# EAGLE schematic SCM-140-ADSR (EAGLE 7.6.0)
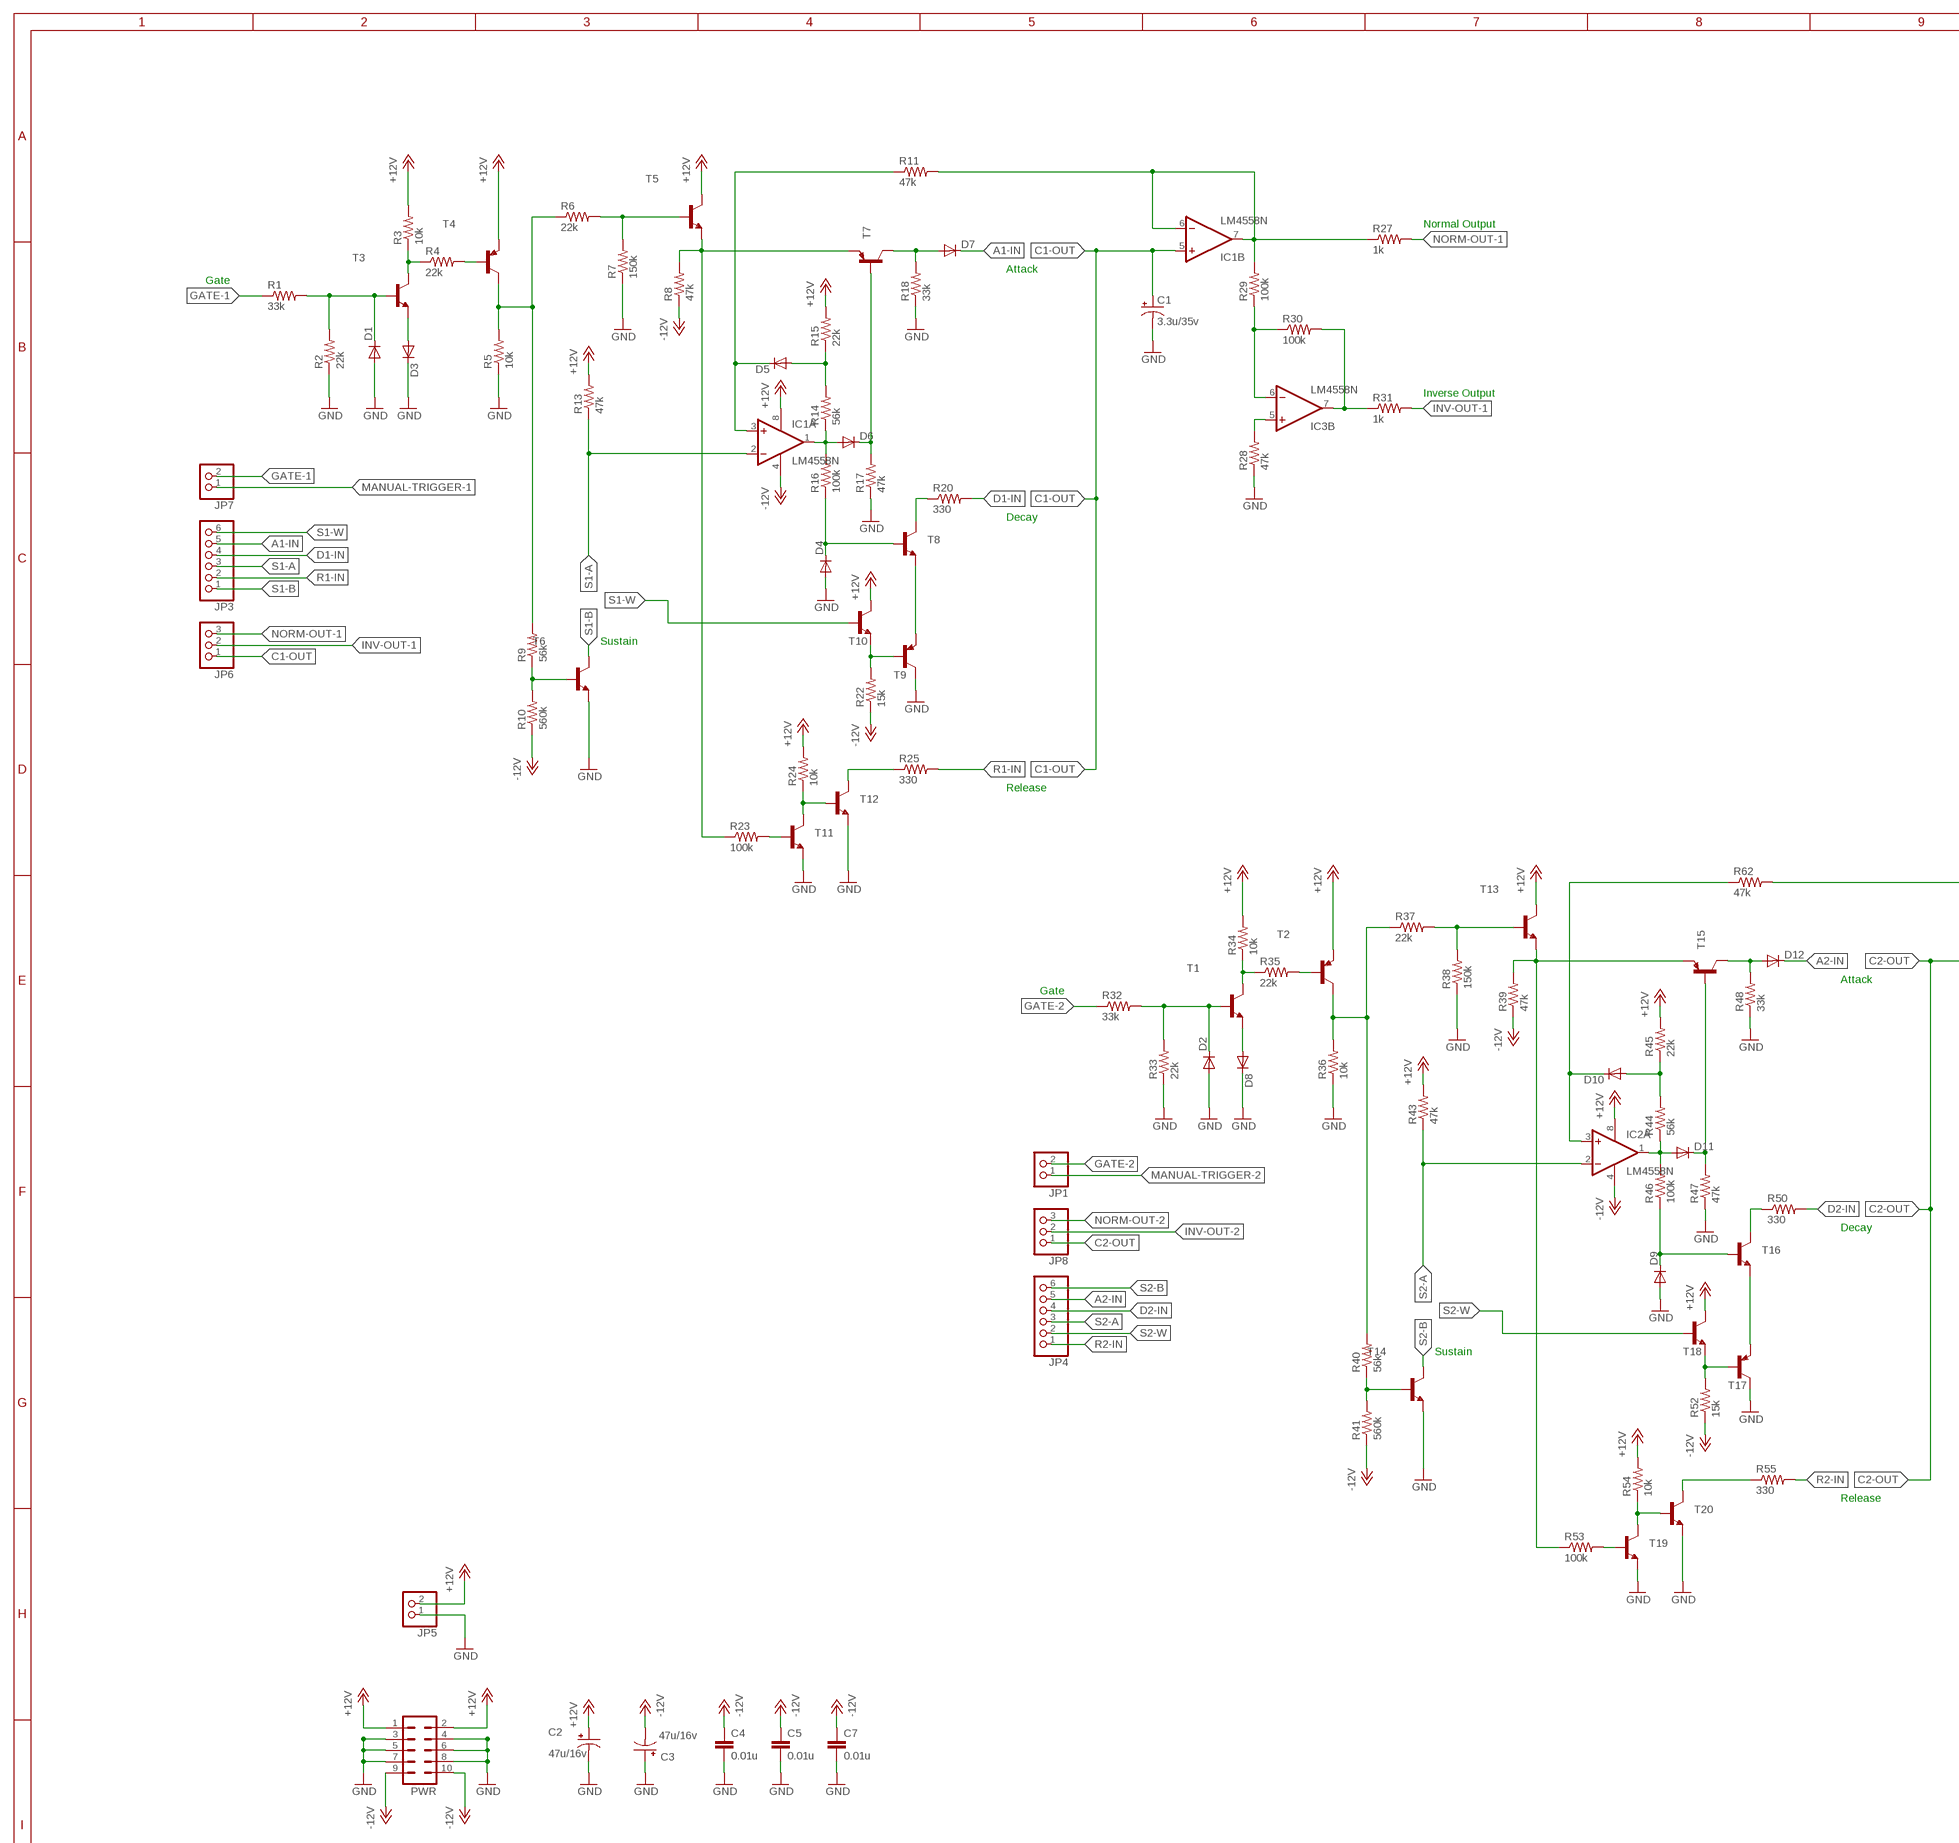
[diagram p0: schematic, sheet 1, part 1 of 2]
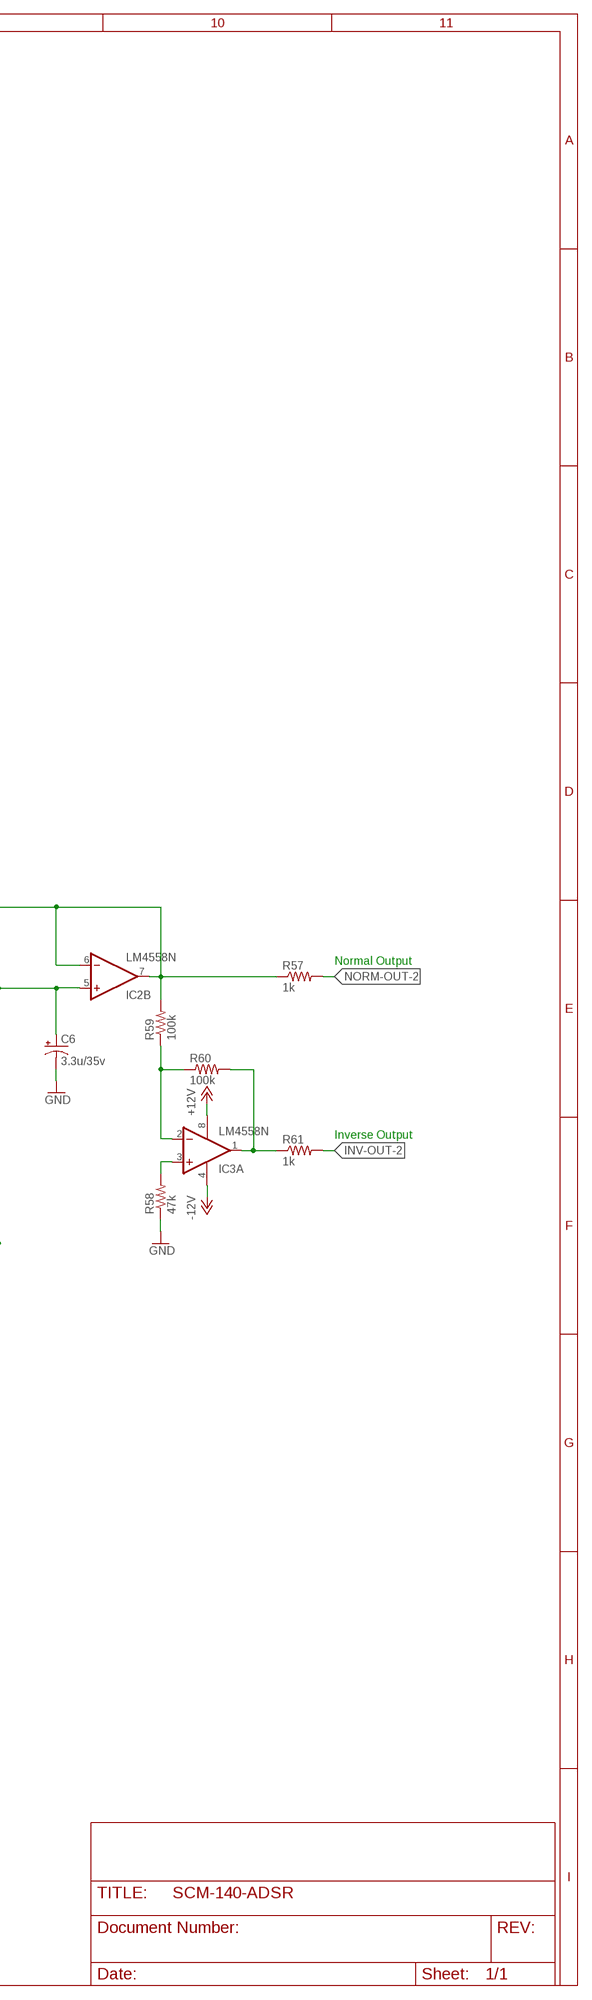
[diagram p1: schematic, sheet 1, part 2 of 2]

## Parts
C1  3.3u/35v  CPOL-USE2.5-5  [E2,5-5]
C2  47u/16v  CPOL-USE2.5-5  [E2,5-5]
C3  47u/16v  CPOL-USE2.5-5  [E2,5-5]
C4  0.01u  C-EU025-024X044  [C025-024X044]
C5  0.01u  C-EU025-024X044  [C025-024X044]
C6  3.3u/35v  CPOL-USE2.5-5  [E2,5-5]
C7  0.01u  C-EU025-024X044  [C025-024X044]
D1  1N4148DO35-7  [DO35-7]
D2  1N4148DO35-7  [DO35-7]
D3  1N4148DO35-7  [DO35-7]
D4  1N4148DO35-7  [DO35-7]
D5  1N4148DO35-7  [DO35-7]
D6  1N4148DO35-7  [DO35-7]
D7  1N4148DO35-7  [DO35-7]
D8  1N4148DO35-7  [DO35-7]
D9  1N4148DO35-7  [DO35-7]
D10  1N4148DO35-7  [DO35-7]
D11  1N4148DO35-7  [DO35-7]
D12  1N4148DO35-7  [DO35-7]
IC1  LM4558N  [DIL08]
IC2  LM4558N  [DIL08]
IC3  LM4558N  [DIL08]
JP1  PINHD-1X2  [1X02]
JP3  PINHD-1X6  [1X06]
JP4  PINHD-1X6  [1X06]
JP5  PINHD-1X2  [1X02]
JP6  PINHD-1X3  [1X03]
JP7  PINHD-1X2  [1X02]
JP8  PINHD-1X3  [1X03]
PWR  ML10  [ML10]
R1  33k  R-US_0204/7  [0204/7]
R2  22k  R-US_0204/7  [0204/7]
R3  10k  R-US_0204/7  [0204/7]
R4  22k  R-US_0204/7  [0204/7]
R5  10k  R-US_0204/7  [0204/7]
R6  22k  R-US_0204/7  [0204/7]
R7  150k  R-US_0204/7  [0204/7]
R8  47k  R-US_0204/7  [0204/7]
R9  56k  R-US_0204/7  [0204/7]
R10  560k  R-US_0204/7  [0204/7]
R11  47k  R-US_0204/7  [0204/7]
R13  47k  R-US_0204/7  [0204/7]
R14  56k  R-US_0204/7  [0204/7]
R15  22k  R-US_0204/7  [0204/7]
R16  100k  R-US_0204/7  [0204/7]
R17  47k  R-US_0204/7  [0204/7]
R18  33k  R-US_0204/7  [0204/7]
R20  330  R-US_0204/7  [0204/7]
R22  15k  R-US_0204/7  [0204/7]
R23  100k  R-US_0204/7  [0204/7]
R24  10k  R-US_0204/7  [0204/7]
R25  330  R-US_0204/7  [0204/7]
R27  1k  R-US_0204/7  [0204/7]
R28  47k  R-US_0204/7  [0204/7]
R29  100k  R-US_0204/7  [0204/7]
R30  100k  R-US_0204/7  [0204/7]
R31  1k  R-US_0204/7  [0204/7]
R32  33k  R-US_0204/7  [0204/7]
R33  22k  R-US_0204/7  [0204/7]
R34  10k  R-US_0204/7  [0204/7]
R35  22k  R-US_0204/7  [0204/7]
R36  10k  R-US_0204/7  [0204/7]
R37  22k  R-US_0204/7  [0204/7]
R38  150k  R-US_0204/7  [0204/7]
R39  47k  R-US_0204/7  [0204/7]
R40  56k  R-US_0204/7  [0204/7]
R41  560k  R-US_0204/7  [0204/7]
R43  47k  R-US_0204/7  [0204/7]
R44  56k  R-US_0204/7  [0204/7]
R45  22k  R-US_0204/7  [0204/7]
R46  100k  R-US_0204/7  [0204/7]
R47  47k  R-US_0204/7  [0204/7]
R48  33k  R-US_0204/7  [0204/7]
R50  330  R-US_0204/7  [0204/7]
R52  15k  R-US_0204/7  [0204/7]
R53  100k  R-US_0204/7  [0204/7]
R54  10k  R-US_0204/7  [0204/7]
R55  330  R-US_0204/7  [0204/7]
R57  1k  R-US_0204/7  [0204/7]
R58  47k  R-US_0204/7  [0204/7]
R59  100k  R-US_0204/7  [0204/7]
R60  100k  R-US_0204/7  [0204/7]
R61  1k  R-US_0204/7  [0204/7]
R62  47k  R-US_0204/7  [0204/7]
T1  BC547B-NPN-TO92-CBE  [TO92-CBE]
T2  BC557B-PNP-TO92-EBC  [TO92-EBC]
T3  BC547B-NPN-TO92-CBE  [TO92-CBE]
T4  BC557B-PNP-TO92-EBC  [TO92-EBC]
T5  BC547B-NPN-TO92-CBE  [TO92-CBE]
T6  BC547B-NPN-TO92-CBE  [TO92-CBE]
T7  BC557B-PNP-TO92-EBC  [TO92-EBC]
T8  BC547B-NPN-TO92-CBE  [TO92-CBE]
T9  BC557B-PNP-TO92-EBC  [TO92-EBC]
T10  BC547B-NPN-TO92-CBE  [TO92-CBE]
T11  BC547B-NPN-TO92-CBE  [TO92-CBE]
T12  BC547B-NPN-TO92-CBE  [TO92-CBE]
T13  BC547B-NPN-TO92-CBE  [TO92-CBE]
T14  BC547B-NPN-TO92-CBE  [TO92-CBE]
T15  BC557B-PNP-TO92-EBC  [TO92-EBC]
T16  BC547B-NPN-TO92-CBE  [TO92-CBE]
T17  BC557B-PNP-TO92-EBC  [TO92-EBC]
T18  BC547B-NPN-TO92-CBE  [TO92-CBE]
T19  BC547B-NPN-TO92-CBE  [TO92-CBE]
T20  BC547B-NPN-TO92-CBE  [TO92-CBE]

## Nets
+12V: C2.+ IC1.8(P:V+) IC2.8(P:V+) IC3.8(P:V+) JP5.2 PWR.1 PWR.2 R3.2 R13.2 R15.2 R24.2 R34.2 R43.2 R45.2 R54.2 T2.E T4.E T5.C T10.C T13.C T18.C
-12V: C3.- C4.1 C5.1 C7.1 IC1.4(P:V-) IC2.4(P:V-) IC3.4(P:V-) PWR.9 PWR.10 R8.1 R10.1 R22.1 R39.1 R41.1 R52.1
A1-IN: D7.C JP3.5
A2-IN: D12.C JP4.5
C1-OUT: C1.+ IC1.5(B:+IN) JP6.1
C2-OUT: C6.+ IC2.5(B:+IN) JP8.1
D1-IN: JP3.4 R20.2
D2-IN: JP4.4 R50.2
GATE-1: JP7.2 R1.1
GATE-2: JP1.2 R32.1
GND: C1.- C2.- C3.+ C4.2 C5.2 C6.- C7.2 D1.A D2.A D3.C D4.A D8.C D9.A JP5.1 PWR.3 PWR.4 PWR.5 PWR.6 PWR.7 PWR.8 R2.1 R5.1 R7.1 R17.1 R18.1 R28.1 R33.1 R36.1 R38.1 R47.1 R48.1 R58.1 T6.E T9.C T11.E T12.E T14.E T17.C T19.E T20.E
INV-OUT-1: JP6.2 R31.2
INV-OUT-2: JP8.2 R61.2
MANUAL-TRIGGER-1: D1.C JP7.1 R1.2 R2.2 T3.B
MANUAL-TRIGGER-2: D2.C JP1.1 R32.2 R33.2 T1.B
N$1: D5.C IC1.3(A:+IN) R11.1
N$3: D3.A T3.E
N$4: R3.1 R4.1 T3.C
N$5: R4.2 T4.B
N$6: R5.2 R6.1 R9.2 T4.C
N$7: R8.2 R23.1 T5.E T7.E
N$8: R6.2 R7.2 T5.B
N$9: R9.1 R10.2 T6.B
N$12: D6.A IC1.1(A:OUT) R14.1 R16.2
N$13: D4.C R16.1 T8.B
N$14: D5.A R14.2 R15.1
N$15: IC1.6(B:-IN) IC1.7(B:OUT) R11.2 R27.1 R29.2
N$16: D7.A R18.2 T7.C
N$17: D6.C R17.2 T7.B
N$21: IC3.6(B:-IN) R29.1 R30.1
N$23: R20.1 T8.C
N$24: R22.2 T9.B T10.E
N$25: T8.E T9.E
N$26: R23.2 T11.B
N$27: R24.1 T11.C T12.B
N$28: R25.1 T12.C
N$30: IC3.7(B:OUT) R30.2 R31.1
N$32: D8.A T1.E
N$33: IC3.5(B:+IN) R28.2
N$34: R34.1 R35.1 T1.C
N$35: R35.2 T2.B
N$36: R36.2 R37.1 R40.2 T2.C
N$37: R39.2 R53.1 T13.E T15.E
N$38: R37.2 R38.2 T13.B
N$39: R40.1 R41.2 T14.B
N$41: D11.A IC2.1(A:OUT) R44.1 R46.2
N$42: D9.C R46.1 T16.B
N$43: D10.A R44.2 R45.1
N$44: IC2.6(B:-IN) IC2.7(B:OUT) R57.1 R59.2 R62.2
N$45: D11.C R47.2 T15.B
N$46: D12.A R48.2 T15.C
N$48: R50.1 T16.C
N$51: R52.2 T17.B T18.E
N$52: T16.E T17.E
N$53: R53.2 T19.B
N$54: R54.1 T19.C T20.B
N$55: R55.1 T20.C
N$58: IC3.2(A:-IN) R59.1 R60.1
N$59: IC3.1(A:OUT) R60.2 R61.1
N$60: IC3.3(A:+IN) R58.2
N$61: D10.C IC2.3(A:+IN) R62.1
NORM-OUT-1: JP6.3 R27.2
NORM-OUT-2: JP8.3 R57.2
R1-IN: JP3.2 R25.2
R2-IN: JP4.1 R55.2
S1-A: IC1.2(A:-IN) JP3.3 R13.1
S1-B: JP3.1 T6.C
S1-W: JP3.6 T10.B
S2-A: IC2.2(A:-IN) JP4.3 R43.1
S2-B: JP4.6 T14.C
S2-W: JP4.2 T18.B

## Notes on the sheet
- Normal Output
- Attack
- Gate
- Inverse Output
- Decay
- Sustain
- Release
- Normal Output
- Attack
- Gate
- Inverse Output
- Decay
- Sustain
- Release

## Library data of the parts
C1-C3 C6 = resistor:CPOL-US: POLARIZED CAPACITOR, American symbol
C4 C5 C7 = resistor:C-EU: CAPACITOR, European symbol
D1-D12 = diode:1N4148: DIODE high speed (Philips)
IC1-IC3 = linear:*4558: OP AMP
JP1 JP5 JP7 = pinhead:PINHD-1X2: PIN HEADER
JP3 JP4 = pinhead:PINHD-1X6: PIN HEADER
JP6 JP8 = pinhead:PINHD-1X3: PIN HEADER
PWR = con-ml:ML10: HARTING; OC_FARNELL: unknown; OC_NEWARK: unknown
R1-R11 R13-R18 R20 R22-R25 R27-R41 R43-R48 R50 R52-R55 R57-R62 = resistor:R-US_: RESISTOR, American symbol
T1 T3 T5 T6 T8 T10-T14 T16 T18-T20 = transistor:*-NPN-: NPN Transistror BF959 corrected 2008.03.06
T2 T4 T7 T9 T15 T17 = transistor:*-PNP-: PNP Transistror